# EAGLE design CPU_Dev_revB.1 (EAGLE 9.1.0)
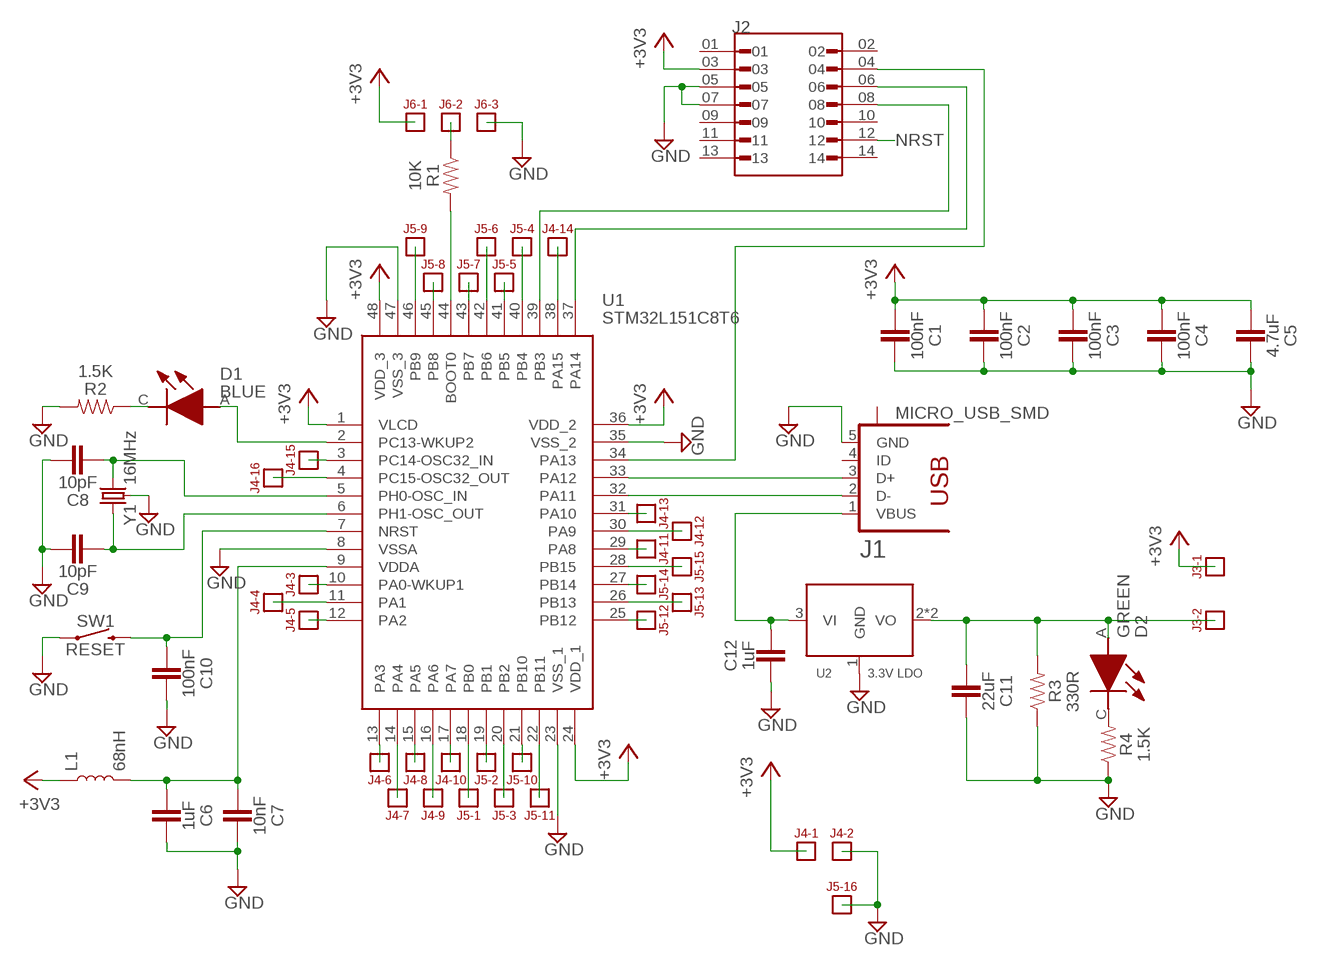
[diagram p0: schematic, sheet 1]

## Parts
C1  100nF  C_0402  [0402]
C2  100nF  C_0402  [0402]
C3  100nF  C_0402  [0402]
C4  100nF  C_0402  [0402]
C5  4.7uF  C_0402  [0402]
C6  1uF  C_0402  [0402]
C7  10nF  C_0402  [0402]
C8  10pF  C_0402  [0402]
C9  10pF  C_0402  [0402]
C10  100nF  C_0402  [0402]
C11  22uF  C_1206  [1206]
C12  1uF  C_0402  [0402]
D1  BLUE  LED_0603  [LED_0603]
D2  GREEN  LED_0603  [LED_0603]
J1  MICRO_USB_SMD  [10118192-0002LF]
J2  HEADER_DEBUG_SMD  [HEADER_DEBUG_SMD]
J3  HEADER_2PIN  [HEADER_2PIN]
J4  HEADER_16PIN  [HEADER_16PIN]
J5  HEADER_16PIN  [HEADER_16PIN]
J6  HEADER_3PIN  [HEADER_3PIN]
L1  68nH  L_0603  [0603]
R1  10K  R_0402  [0402]
R2  1.5K  R_0402  [0402]
R3  330R  R_0402  [0402]
R4  1.5K  R_0402  [0402]
SW1  RESET  PUSHBUTTON_SMD  [PUSHBUTTON_SMD]
U1  STM32L151C8T6  [LQFP-48_7X7]
U2  3.3V LDO  VREG_SOT223  [SOT223]
Y1  16MHz  XTAL_SMD3225-4P  [SMD3225-4P]

## Nets
+3V3: C1.1 C2.1 C3.1 C4.1 C5.1 J2.03 J3.P$1 J4.P$1 J6.P$1 L1.1 U1.1(VLCD) U1.24(VDD_1) U1.36(VDD_2) U1.48(VDD_3)
BOOT0: R1.2 U1.44(BOOT0)
GND: C1.2 C2.2 C3.2 C4.2 C5.2 C6.2 C7.2 C8.2 C9.2 C10.2 C11.2 C12.1 J1.5(GND) J2.05 J2.07 J4.P$2 J5.P$16 J6.P$3 R2.2 R3.1 R4.1 SW1.A1 SW1.B1 U1.8(VSSA) U1.23(VSS_1) U1.35(VSS_2) U1.47(VSS_3) U2.1(GND) Y1.2 Y1.4
N$1: C12.2 J1.1(VBUS) U2.3(VI)
N$2: C11.1 D2.A J3.P$2 R3.2 U2.2(VO) U2.4(VO)
N$3: J2.04 U1.34(PA13)
N$4: D2.C(K) R4.2
N$5: J2.06 U1.37(PA14)
N$6: J2.08 U1.39(PB3)
N$8: D1.C(K) R2.1
N$9: J6.P$2 R1.1
NRST: C10.1 J2.12 SW1.C1 SW1.D1 U1.7(NRST)
PA0: J4.P$3 U1.10(PA0-WKUP1)
PA1: J4.P$4 U1.11(PA1)
PA2: J4.P$5 U1.12(PA2)
PA3: J4.P$6 U1.13(PA3)
PA4: J4.P$7 U1.14(PA4)
PA5: J4.P$8 U1.15(PA5)
PA6: J4.P$9 U1.16(PA6)
PA7: J4.P$10 U1.17(PA7)
PA8: J4.P$11 U1.29(PA8)
PA9: J4.P$12 U1.30(PA9)
PA10: J4.P$13 U1.31(PA10)
PA11: J1.2(D-) U1.32(PA11)
PA12: J1.3(D+) U1.33(PA12)
PA15: J4.P$14 U1.38(PA15)
PB0: J5.P$1 U1.18(PB0)
PB1: J5.P$2 U1.19(PB1)
PB2: J5.P$3 U1.20(PB2)
PB4: J5.P$4 U1.40(PB4)
PB5: J5.P$5 U1.41(PB5)
PB6: J5.P$6 U1.42(PB6)
PB7: J5.P$7 U1.43(PB7)
PB8: J5.P$8 U1.45(PB8)
PB9: J5.P$9 U1.46(PB9)
PB10: J5.P$10 U1.21(PB10)
PB11: J5.P$11 U1.22(PB11)
PB12: J5.P$12 U1.25(PB12)
PB13: J5.P$13 U1.26(PB13)
PB14: J5.P$14 U1.27(PB14)
PB15: J5.P$15 U1.28(PB15)
PC14: J4.P$15 U1.3(PC14-OSC32_IN)
PC15: J4.P$16 U1.4(PC15-OSC32_OUT)
PH0: C8.1 U1.5(PH0-OSC_IN) Y1.3
PH1: C9.1 U1.6(PH1-OSC_OUT) Y1.1
VDDA: C6.1 C7.1 L1.2 U1.9(VDDA)
WKUP: D1.A U1.2(PC13-WKUP2)
Unconnected: J1.4(ID) J1.S1 J2.01 J2.02 J2.09 J2.10 J2.11 J2.13 J2.14

## Library data of the parts
C1-C10 C12 = NSE LABS:C_0402: Samsung Source: Datasheet <https://datasheet.lcsc.com/szlcsc/Samsung-Electro-Mechanics-CL05B104KB54PNC_C307331.pdf>
C11 = NSE LABS:C_1206
D1 D2 = NSE LABS:LED_0603
J1 = NSE LABS:MICRO_USB_SMD: Receptacle, micro-USB, type A/B Tyco Electronics
J2 = NSE LABS:HEADER_DEBUG_SMD
J3 = NSE LABS:HEADER_2PIN
J4 J5 = NSE LABS:HEADER_16PIN
J6 = NSE LABS:HEADER_3PIN
L1 = NSE LABS:L_0603
R1-R4 = NSE LABS:R_0402
SW1 = NSE LABS:PUSHBUTTON_SMD
U1 = NSE LABS:STM32L151C8T6: MCU 32-bit ARM Cortex M3 RISC 64KB Flash 2.5V/3.3V 48-Pin LQFP Tray Source: Datasheet <https://www.st.com/resource/en/datasheet/stm32l151c8.pdf>; ARROW_PART_NUMBER: STM32L151C8T6; ARROW_PRICE-STOCK: https://www.arrow.com/en/products/stm32l151c8t6/stmicroelectronics?region=nac; DESCRIPTION: MCU 32-bit ARM Cortex M3 RISC 64KB Flash 2.5V/3.3V 48-Pin LQFP Tray; HEIGHT: 1.6mm; MANUFACTURER_NAME: STMicroelectronics; MANUFACTURER_PART_NUMBER: STM32L151C8T6; MOUSER_PART_NUMBER: 511-STM32L151C8T6; MOUSER_PRICE-STOCK: https://www.mouser.co.uk/ProductDetail/STMicroelectronics/STM32L151C8T6?qs=G0rgft3hAxIeaXnyBBjaCA%3D%3D
U2 = NSE LABS:VREG_SOT223
Y1 = NSE LABS:XTAL_SMD3225-4P

## Board
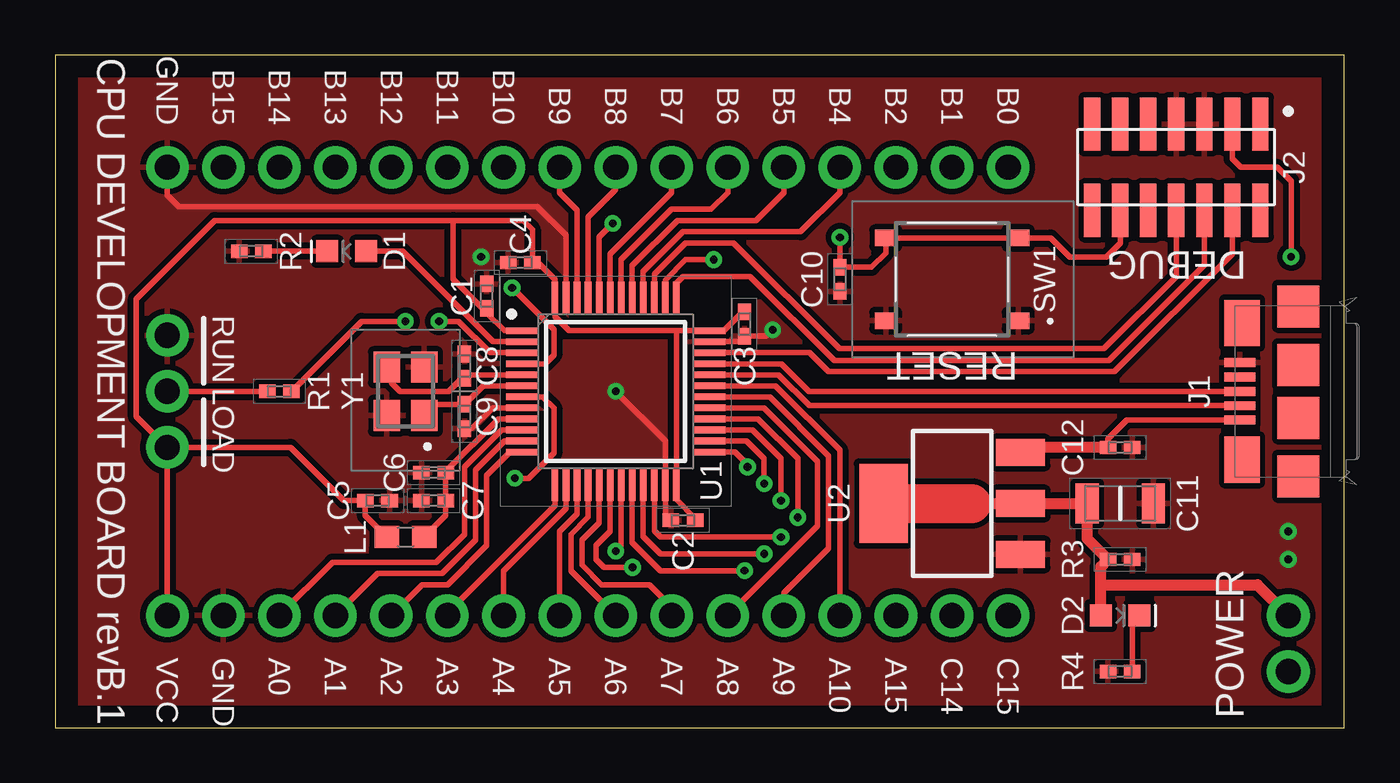
[diagram p1: board, top side]
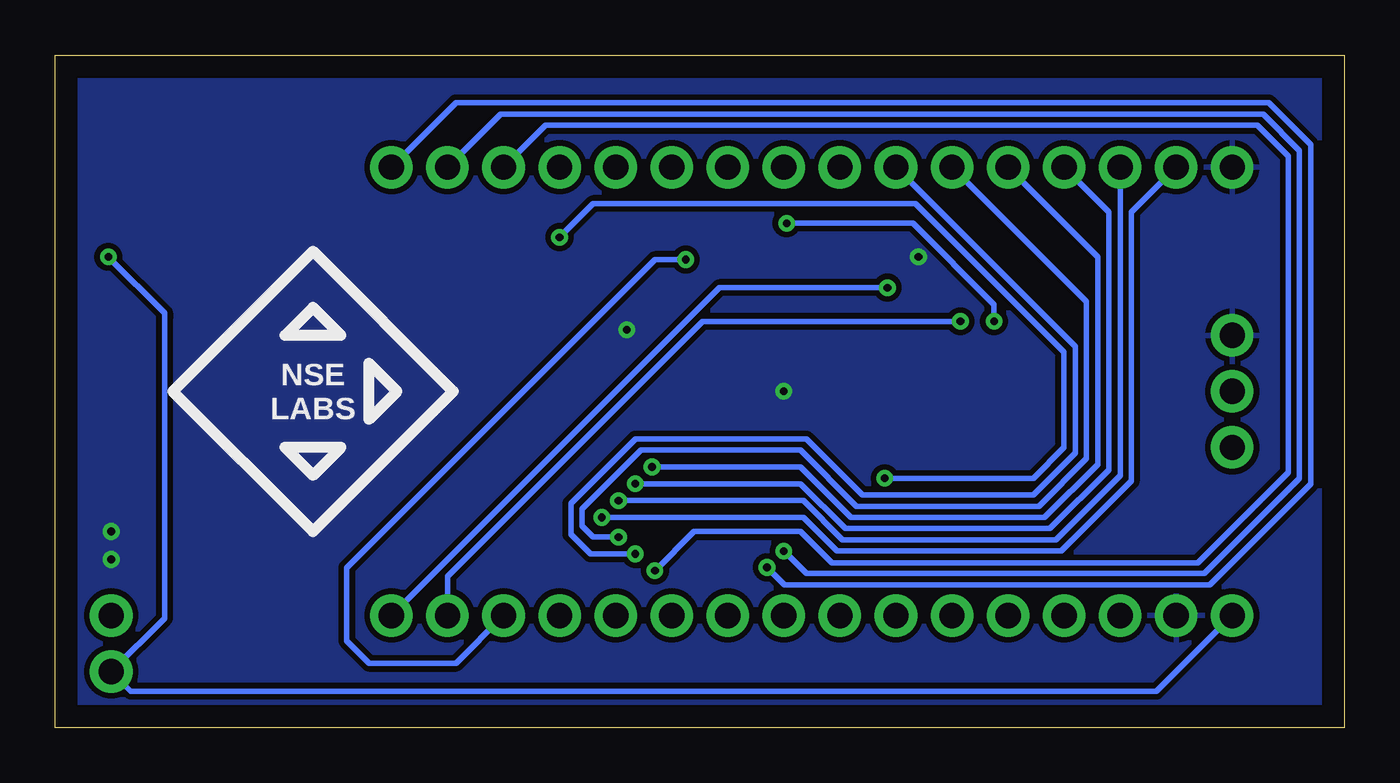
[diagram p2: board, bottom side, seen from below]

Size 58.42 x 30.48 mm. Coordinates in mm from the lower left corner, seen from the top.
Outline: 0,0 58.42,0 58.42,30.48 0,30.48 0,0
Copper layers (1*16): Top 0.035mm / dielectric 1.5mm / Bottom 0.035mm
Design rules "default": minimum track width 6mil, minimum drill 0.35mm, track to track 6mil, track to pad 6mil, pad to pad 6mil, via to via 6mil, smd to smd 6mil, copper to edge 40mil, drill to drill 6mil, minimum pad ring 10mil, minimum via ring 8mil, stop-mask expansion 4mil, vias tented up to drill 0mil, thermal gap 10mil

### Footprints (pad centres in the part's own frame; a part is rotated, then mirrored left to right if it is on the bottom)
0402 = smd 0.75 x 0.6: 1 -0.55,0; 2 0.55,0
1206 = smd 1.05 x 1.8: 1 -1.5,0; 2 1.5,0
LED_0603 = smd 1 x 1: A -0.877,0; C 0.877,0
10118192-0002LF = smd 0.4 x 1.4: 1 -1.3,1.2; 2 -0.65,1.2; 3 0,1.2; 4 0.65,1.2; 5 1.3,1.2 | smd 1.9 x 1.9: M1 -1.2,-1.45; M2 1.2,-1.45; S1 -3.85,-1.45; S2 3.85,-1.45 | smd 2.1 x 1.6: S3 -3.1,1.1; S4 3.1,1.1
HEADER_DEBUG_SMD = smd 0.737 x 2.413: 01 -3.81,-1.956; 02 -3.81,1.956; 03 -2.54,-1.956; 04 -2.54,1.956; 05 -1.27,-1.956; 06 -1.27,1.956; 07 0,-1.956; 08 0,1.956; 09 1.27,-1.956; 10 1.27,1.956; 11 2.54,-1.956; 12 2.54,1.956; 13 3.81,-1.956; 14 3.81,1.956
HEADER_2PIN = drill 1.143 pad 1.93: P$1 -1.27,0; P$2 1.27,0
HEADER_16PIN = drill 1.143 pad 1.93: P$1 -19.05,0; P$2 -16.51,0; P$3 -13.97,0; P$4 -11.43,0; P$5 -8.89,0; P$6 -6.35,0; P$7 -3.81,0; P$8 -1.27,0; P$9 1.27,0; P$10 3.81,0; P$11 6.35,0; P$12 8.89,0; P$13 11.43,0; P$14 13.97,0; P$15 16.51,0; P$16 19.05,0
HEADER_3PIN = drill 1.143 pad 1.93: P$1 -2.54,0; P$2 0,0; P$3 2.54,0
0603 = smd 1.1 x 1: 1 -0.85,0; 2 0.85,0
PUSHBUTTON_SMD = smd 1 x 0.75: A1 -3,1.875; B1 3,1.875; C1 -3,-1.875; D1 3,-1.875
LQFP-48_7X7 = smd 1.475 x 0.3: 1 -4.238,2.75; 2 -4.238,2.25; 3 -4.238,1.75; 4 -4.238,1.25; 5 -4.238,0.75; 6 -4.238,0.25; 7 -4.238,-0.25; 8 -4.238,-0.75; 9 -4.238,-1.25; 10 -4.238,-1.75; 11 -4.238,-2.25; 12 -4.238,-2.75; 25 4.238,-2.75; 26 4.238,-2.25; 27 4.238,-1.75; 28 4.238,-1.25; 29 4.238,-0.75; 30 4.238,-0.25; 31 4.238,0.25; 32 4.238,0.75; 33 4.238,1.25; 34 4.238,1.75; 35 4.238,2.25; 36 4.238,2.75 | smd 0.3 x 1.475: 13 -2.75,-4.238; 14 -2.25,-4.238; 15 -1.75,-4.238; 16 -1.25,-4.238; 17 -0.75,-4.238; 18 -0.25,-4.238; 19 0.25,-4.238; 20 0.75,-4.238; 21 1.25,-4.238; 22 1.75,-4.238; 23 2.25,-4.238; 24 2.75,-4.238; 37 2.75,4.238; 38 2.25,4.238; 39 1.75,4.238; 40 1.25,4.238; 41 0.75,4.238; 42 0.25,4.238; 43 -0.25,4.238; 44 -0.75,4.238; 45 -1.25,4.238; 46 -1.75,4.238; 47 -2.25,4.238; 48 -2.75,4.238
SOT223 = smd 1.219 x 2.235: 1 -2.311,-3.099; 2 0,-3.099; 3 2.311,-3.099 | smd 3.6 x 2.2: 4 0,3.099
SMD3225-4P = smd 1.4 x 1.2: 1 -1.1,-0.85; 2 1.1,-0.85; 3 1.1,0.85; 4 -1.1,0.85

### Placement (x,y rotation side)
C1  19.56,19.56 90 top
C2  28.45,9.4 180 top
C3  31.24,18.29 270 top
C4  21.08,21.08 180 top
C5  14.61,10.29 0 top
C6  17.14,11.56 180 top
C7  17.14,10.29 180 top
C8  18.54,16.38 90 top
C9  18.54,14.1 270 top
C10  35.56,20.32 270 top
C11  48.26,10.16 0 top
C12  48.26,12.7 180 top
D1  13.21,21.59 180 top
D2  48.26,5.08 0 top
J1  54.88,15.24 90 top
J2  50.8,25.4 180 top
J3  55.88,3.81 90 top
J4  24.13,5.08 0 top
J5  24.13,25.4 180 top
J6  5.08,15.24 90 top
L1  15.88,8.64 0 top
R1  10.16,15.24 0 top
R2  8.89,21.59 180 top
R3  48.26,7.62 180 top
R4  48.26,2.54 0 top
SW1  40.64,20.32 180 top
U1  25.4,15.24 0 top
U2  40.64,10.16 90 top
Y1  15.88,15.24 90 top

### Tracks (layer width: path | path; a pad name or v marks a point on that pad's centre or on a via)
+3V3  (via drill 0.35)
  Top 0.254: C2.1 29,9.48 28.15,10.33 U1.24 28.15,17.95 28.19,17.99 | U1.1 20.36,17.99 19.56,18.8 C1.1 19.35,19.01 18.03,20.32 18.03,22.99 | L1.1 14.05,9.61 C5.1 13.08,10.29 10.67,12.7 J6.P$1 | J6.P$1 J4.P$1 | 28.19,17.99 23.29,17.99 22.65,18.62 U1.48 22.65,20.32 21.89,21.08 C4.1 21.63,22.56 21.21,22.99 18.03,22.99 | 28.19,17.99 U1.36 30.31,17.99 31.16,18.84 C3.1 | J6.P$1 3.68,14.1 3.68,19.43 7.24,22.99 18.03,22.99 | J2.03 53.34,25.78 53.72,25.4 55.37,25.4 56.01,24.77 v56.01,21.34
  Bottom 0.254: J4.P$1 8.51,1.65 54.99,1.65 J3.P$1 53.47,4.95 53.47,18.54 53.47,18.8 v56.01,21.34
BOOT0  (via drill 0.35)
  Top 0.254: R1.2 13.88,18.41 v15.88,18.41 | v25.27,22.86 24.65,22.24 U1.44
  Bottom 0.254: v25.27,22.86 19.56,22.86 15.88,19.18 v15.88,18.41
GND  (via drill 0.35)
  Top 0.254: U1.35 30.99,17.49 C3.2 32.22,17.74 v32.51,18.03 | C2.2 27.65,9.65 U1.23 27.65,12.99 v25.4,15.24 | U1.8 19.82,14.49 18.88,13.55 C9.2 | U1.47 23.15,22.32 21.84,23.62 5.59,23.62 5.08,24.13 J5.P$16
  other vias: 19.3,21.34 55.88,8.89 55.88,7.62
  pour Top (isolate 0.254): 0,0 58.42,0 58.42,30.48 0,30.48
  pour Bottom (isolate 0.254): 0,0 58.42,0 58.42,30.48 0,30.48
N$1
  Top 0.254: 43.97,12.7 U2.3 | J1.1 48.57,13.94 47.71,13.08 C12.2
  Top 0.508: C12.2 43.97,12.7
N$2
  Top 0.508: D2.A 47.38,6.48 | 47.38,6.48 47.38,7.29 R3.2 46.76,8.57 C11.1 U2.2 41.53,10.16 | 47.38,6.48 54.48,6.48 J3.P$2
  Top 1.778: U2.4 41.53,10.16
N$3
  Top 0.254: J2.04 53.34,21.46 48.01,16.13 35.05,16.13 34.19,16.99 U1.34
N$4
  Top 0.254: R4.2 48.81,4.75 D2.C
N$5
  Top 0.254: J2.06 52.07,20.95 47.75,16.64 35.31,16.64 31.5,20.45 28.45,20.45 28.15,20.15 U1.37
N$6
  Top 0.254: U1.39 27.15,20.55 28.57,21.97 30.73,21.97 35.53,17.17 47.52,17.17 50.8,20.45 J2.08
N$8
  Top 0.254: D1.C R2.1
N$9
  Top 0.254: J6.P$2 R1.1
NRST  (via drill 0.35)
  Top 0.254: J2.12 48.26,21.97 47.62,21.34 45.97,21.34 45.12,22.2 SW1.C1 SW1.D1 37.64,21.51 37,20.87 C10.1 v35.56,22.23 | U1.7 22.09,14.99 22.61,14.48 22.61,12.45 21.46,11.3 v20.83,11.3
  Bottom 0.254: v20.83,11.3 14.1,11.3 12.7,12.7 12.7,17.02 19.43,23.75 34.04,23.75 v35.56,22.23
PA0
  Top 0.254: U1.10 20.22,13.49 18.54,11.81 18.54,8.76 17.27,7.49 12.57,7.49 J4.P$3
PA1
  Top 0.254: J4.P$4 14.61,6.99 17.53,6.99 19.05,8.51 19.05,11.68 20.36,12.99 U1.11
PA2
  Top 0.254: U1.12 20.62,12.49 19.56,11.43 19.56,8.26 17.78,6.48 16.64,6.48 J4.P$5
PA3
  Top 0.254: U1.13 22.65,10.08 17.78,5.21 J4.P$6
PA4
  Top 0.254: U1.14 23.15,9.94 20.32,7.11 J4.P$7
PA5
  Top 0.254: U1.15 23.65,9.68 22.86,8.89 J4.P$8
PA6
  Top 0.254: U1.16 24.15,9.54 23.37,8.76 23.37,7.11 J4.P$9
PA7
  Top 0.254: U1.17 24.65,9.28 23.88,8.51 23.88,7.37 24.77,6.48 26.92,6.48 27.94,5.46 J4.P$10
PA8
  Top 0.254: U1.29 32.12,14.49 34.54,12.06 34.54,9.14 J4.P$11
PA9
  Top 0.254: U1.30 32.38,14.99 35.05,12.32 35.05,8.13 33.02,6.1 J4.P$12
PA10
  Top 0.254: U1.31 32.64,15.49 35.56,12.57 J4.P$13
PA11
  Top 0.254: J1.2 34.18,14.59 32.78,15.99 U1.32
PA12
  Top 0.254: J1.3 34.16,15.24 32.91,16.49 U1.33
PA15  (via drill 0.35)
  Top 0.254: U1.38 27.65,20.28 28.57,21.21 v29.84,21.21
  Bottom 0.254: J4.P$14 40.26,2.92 44.2,2.92 45.21,3.94 45.21,7.24 31.24,21.21 v29.84,21.21
PB0  (via drill 0.35)
  Top 0.254: v26.16,7.26 24.87,7.26 24.51,7.62 24.51,8.26 25.15,8.89 U1.18
  Bottom 0.254: J5.P$1 40.26,28.32 3.43,28.32 1.52,26.42 1.52,11.05 6.1,6.48 25.38,6.48 v26.16,7.26
PB1  (via drill 0.35)
  Top 0.254: v25.4,8 25.65,8.25 U1.19
  Bottom 0.254: J5.P$2 38.23,27.81 3.68,27.81 2.03,26.16 2.03,11.3 6.35,6.99 24.38,6.99 v25.4,8
PB2  (via drill 0.35)
  Top 0.254: v31.24,7.11 27.43,7.11 26.15,8.39 U1.20
  Bottom 0.254: J5.P$3 36.2,27.3 3.94,27.3 2.54,25.91 2.54,11.56 6.63,7.47 23.22,7.47 24.64,8.89 29.46,8.89 v31.24,7.11
PB4
  Top 0.254: U1.40 26.65,20.68 28.45,22.48 33.78,22.48 35.56,24.26 J5.P$4
PB5
  Top 0.254: U1.41 26.15,20.94 28.19,22.99 31.75,22.99 33.02,24.26 J5.P$5
PB6
  Top 0.254: U1.42 25.65,21.2 27.94,23.5 29.72,23.5 30.48,24.26 J5.P$6
PB7
  Top 0.254: U1.43 25.15,21.47 27.94,24.26 J5.P$7
PB8
  Top 0.254: U1.45 24.15,23.13 25.4,24.38 J5.P$8
PB9
  Top 0.254: U1.46 23.65,23.47 22.86,24.26 J5.P$9
PB10  (via drill 0.35)
  Top 0.254: U1.21 26.65,8.66 27.43,7.87 v32.13,7.87
  Bottom 0.254: v32.13,7.87 34.16,7.87 35.05,8.76 35.05,10.16 32.13,13.08 24.38,13.08 21.84,10.54 14.1,10.54 12.19,12.45 12.19,17.27 18.29,23.37 J5.P$10
PB11  (via drill 0.35)
  Top 0.254: U1.22 27.15,8.92 27.43,8.64 v32.89,8.64
  Bottom 0.254: v32.89,8.64 34.04,8.64 34.54,9.14 34.54,9.91 31.88,12.57 24.64,12.57 22.1,10.03 13.84,10.03 11.68,12.19 11.68,19.3 J5.P$11
PB12  (via drill 0.35)
  Top 0.254: U1.25 30.82,12.49 31.37,11.94 v31.37,11.81
  Bottom 0.254: v31.37,11.81 24.64,11.81 22.35,9.53 13.59,9.53 11.18,11.94 11.18,21.34 J5.P$12
PB13  (via drill 0.35)
  Top 0.254: v32.13,11.05 32.13,12.19 31.33,12.99 U1.26
  Bottom 0.254: J5.P$13 10.67,23.37 10.67,11.68 13.34,9.02 22.61,9.02 24.64,11.05 v32.13,11.05
PB14  (via drill 0.35)
  Top 0.254: v32.89,10.29 32.89,12.19 31.59,13.49 U1.27
  Bottom 0.254: J5.P$14 10.16,11.43 13.08,8.51 22.73,8.51 24.51,10.29 30.99,10.29 v32.89,10.29
PB15  (via drill 0.35)
  Top 0.254: v33.66,9.53 33.66,12.19 31.86,13.99 U1.28
  Bottom 0.254: J5.P$15 9.65,23.37 9.65,11.18 12.83,8 22.99,8 24.51,9.53 30.99,9.53 v33.66,9.53
PC14  (via drill 0.35)
  Top 0.254: U1.3 19.71,16.99 18.29,18.41 v17.4,18.41
  Bottom 0.254: v17.4,18.41 29.08,18.41 40.64,6.86 J4.P$15
PC15  (via drill 0.35)
  Top 0.254: v20.7,19.94 22.61,18.03 22.61,16.89 22.2,16.49 U1.4
  Bottom 0.254: J4.P$16 28.32,19.94 v20.7,19.94
PH0
  Top 0.254: U1.5 18.7,15.99 C8.1 18.41,15.83 17.82,15.24 15.62,15.24 15.24,15.62 15.24,16.12 Y1.3
PH1
  Top 0.254: U1.6 19.39,15.49 C9.1 17.23,14.65 Y1.1
VDDA
  Top 0.254: L1.2 17.7,9.61 C7.1 C6.1 17.7,11.6 20.09,13.99 U1.9
WKUP
  Top 0.254: U1.2 19.85,17.49 15.75,21.59 D1.A

### Text on the board
tPlace: GND | B15 | B14 | B13 | B12 | B11 | B10 | B9 | B8 | B7 | B6 | B5 | B4 | B2 | B1 | B0 | DEBUG | RUN | RESET | CPU DEVELOPMENT BOARD revB.1 | LOAD | POWER | VCC | GND | A0 | A1 | A2 | A3 | A4 | A5 | A6 | A7 | A8 | A9 | A10 | A15 | C14 | C15
bPlace: NSE / LABS